# Altium schematic sheet Top.SchDoc
size A1; SheetNumber: 1; SheetTotal: 14
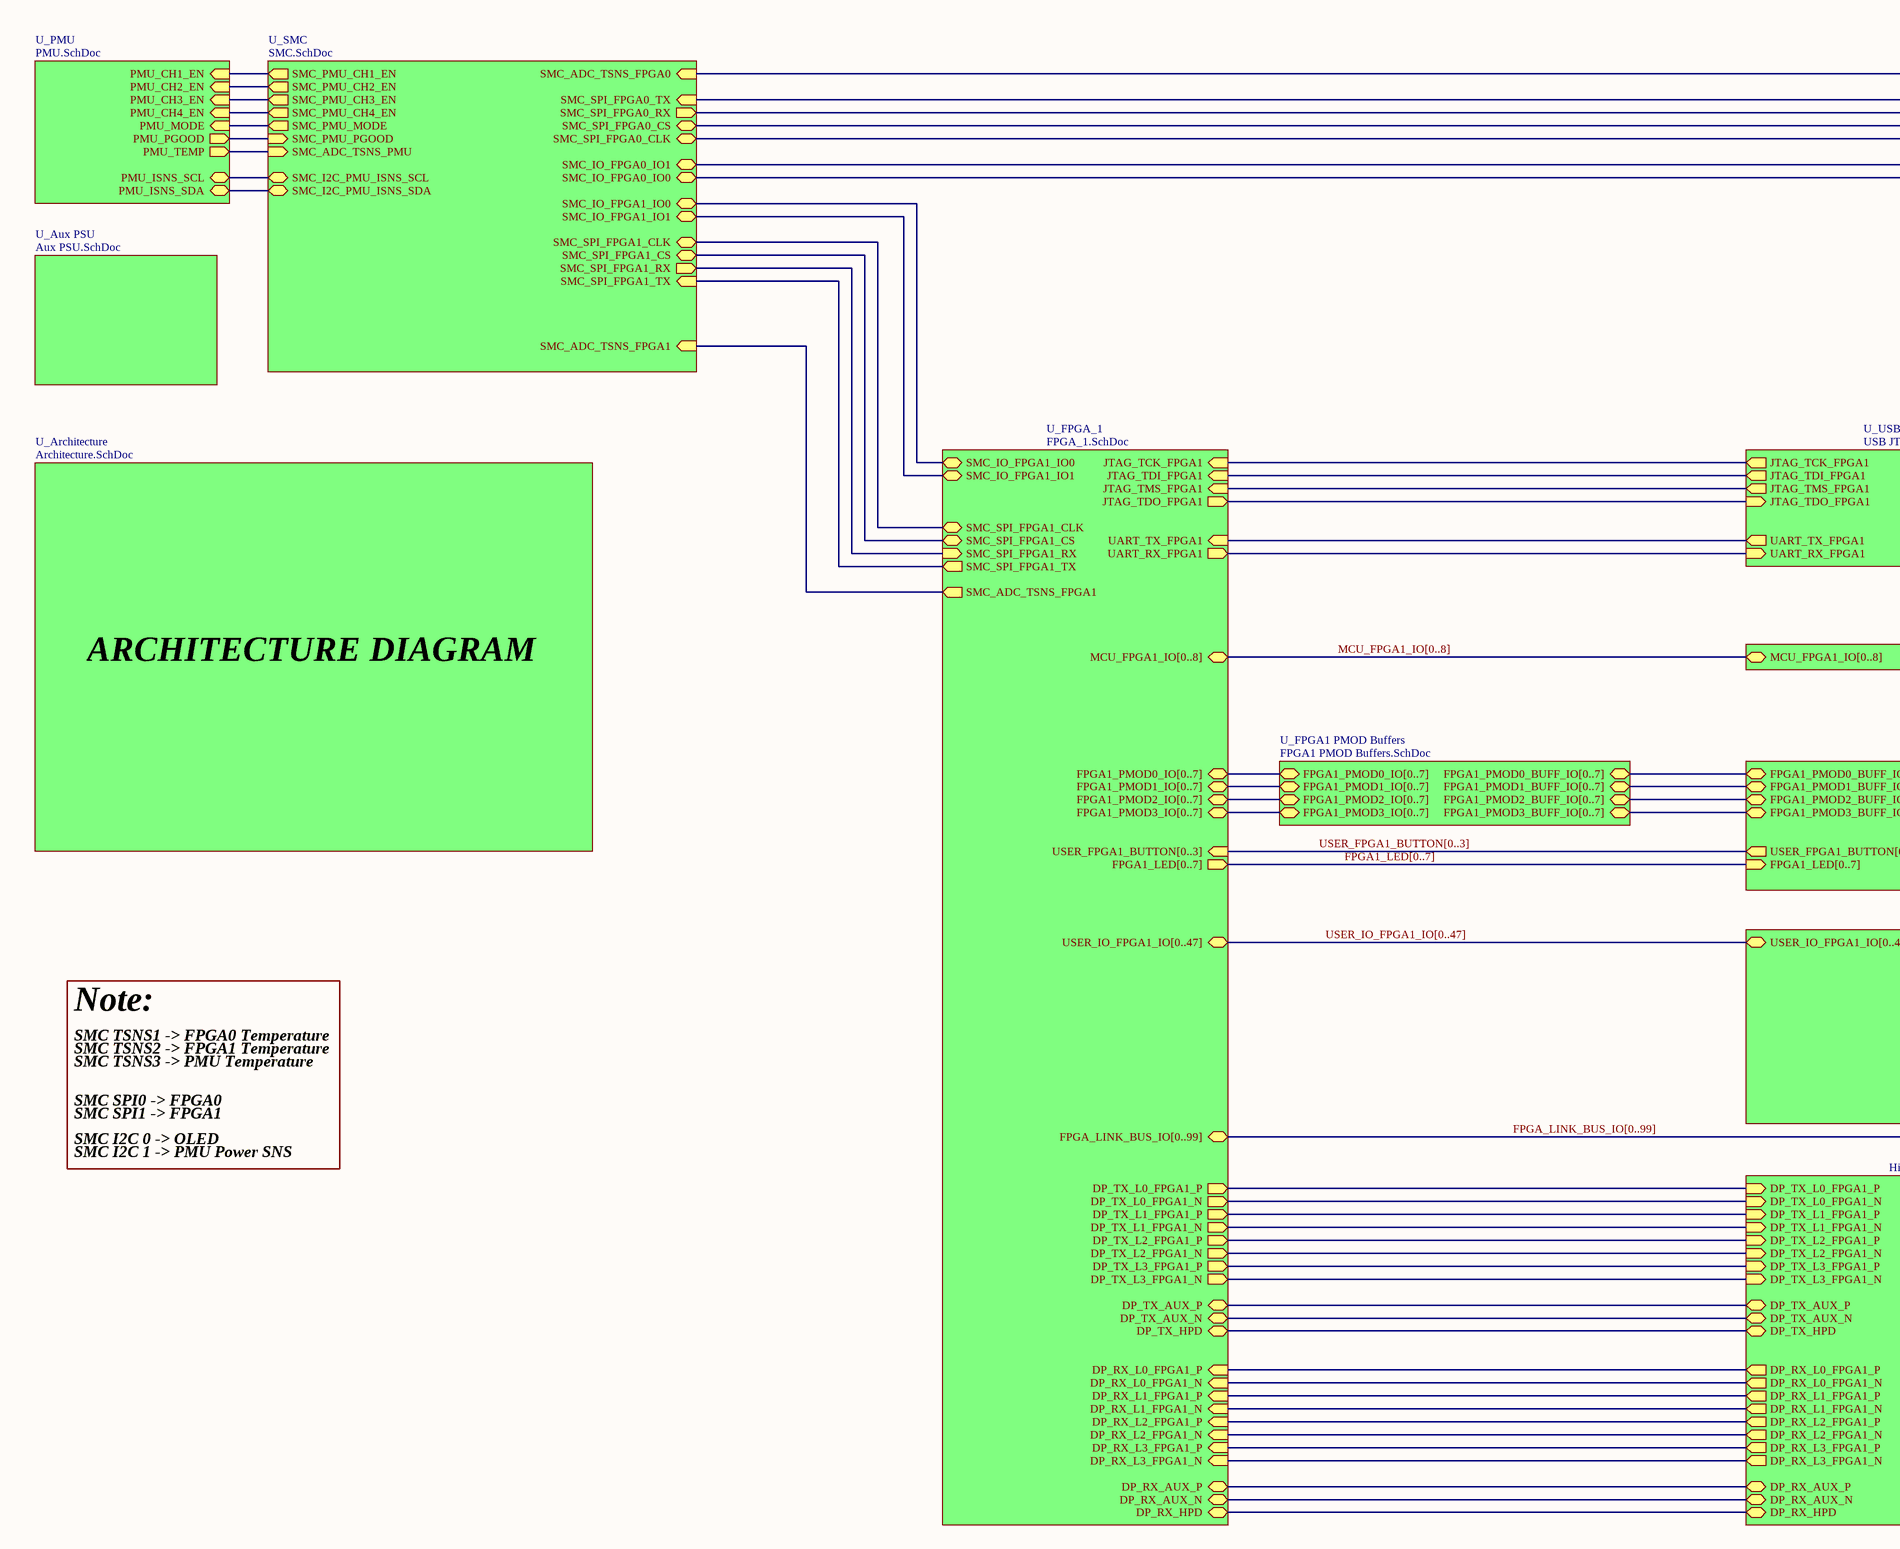
[diagram p0: Top.SchDoc, top left]
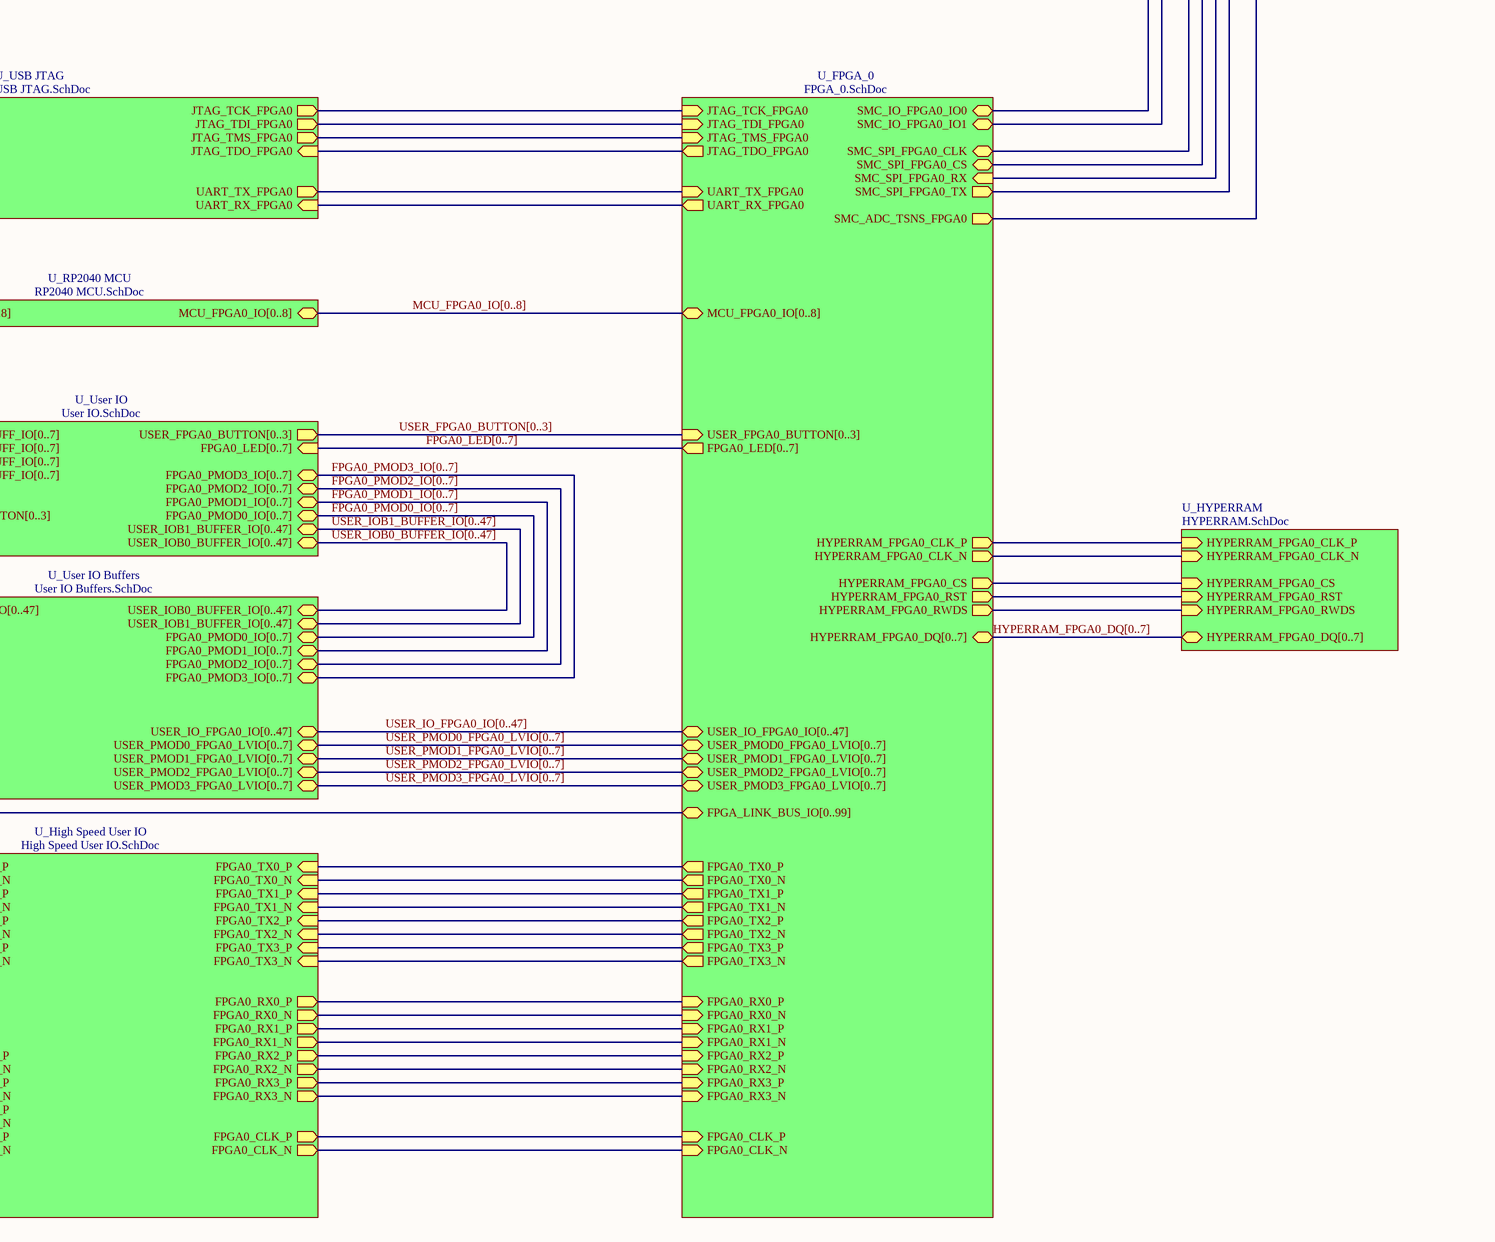
[diagram p1: Top.SchDoc, top right]
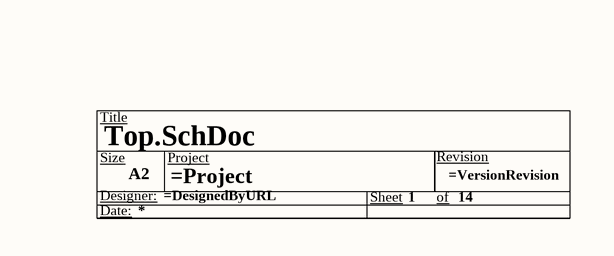
[diagram p2: Top.SchDoc, bottom right]

## Parts
*  Size: A2  (hidden comment: Title Block)  (graphical)

## Sub-sheets
U_Architecture = Architecture.SchDoc: no entries
U_Aux PSU = Aux PSU.SchDoc: no entries
U_FPGA1 PMOD Buffers = FPGA1 PMOD Buffers.SchDoc: FPGA1_PMOD0_IO[0..7] (bidir), FPGA1_PMOD1_IO[0..7] (bidir), FPGA1_PMOD2_IO[0..7] (bidir), FPGA1_PMOD3_IO[0..7] (bidir), FPGA1_PMOD1_BUFF_IO[0..7] (bidir), FPGA1_PMOD2_BUFF_IO[0..7] (bidir), FPGA1_PMOD3_BUFF_IO[0..7] (bidir), FPGA1_PMOD0_BUFF_IO[0..7] (bidir)
U_FPGA_0 = FPGA_0.SchDoc: JTAG_TDO_FPGA0 (out), UART_TX_FPGA0 (in), UART_RX_FPGA0 (out), JTAG_TCK_FPGA0 (in), JTAG_TDI_FPGA0 (in), JTAG_TMS_FPGA0 (in), SMC_IO_FPGA0_IO0 (bidir), SMC_IO_FPGA0_IO1 (bidir), MCU_FPGA0_IO[0..8] (bidir), SMC_SPI_FPGA0_RX (in), SMC_SPI_FPGA0_CS (bidir), SMC_SPI_FPGA0_CLK (bidir), SMC_SPI_FPGA0_TX (out), USER_FPGA0_BUTTON[0..3] (in), FPGA0_LED[0..7] (out), FPGA_LINK_BUS_IO[0..99] (bidir), USER_IO_FPGA0_IO[0..47] (bidir), FPGA0_TX0_P (out), FPGA0_TX0_N (out), FPGA0_TX1_P (out), FPGA0_TX1_N (out), FPGA0_TX2_P (out), FPGA0_TX2_N (out), FPGA0_TX3_P (out), FPGA0_TX3_N (out), FPGA0_RX0_P (in), FPGA0_RX0_N (in), FPGA0_RX1_P (in), FPGA0_RX1_N (in), FPGA0_RX2_P (in), FPGA0_RX2_N (in), FPGA0_RX3_P (in), FPGA0_RX3_N (in), FPGA0_CLK_N (in), FPGA0_CLK_P (in), HYPERRAM_FPGA0_CS (out), HYPERRAM_FPGA0_RWDS (out), HYPERRAM_FPGA0_DQ[0..7] (bidir), HYPERRAM_FPGA0_RST (out), USER_PMOD0_FPGA0_LVIO[0..7] (bidir), USER_PMOD1_FPGA0_LVIO[0..7] (bidir), USER_PMOD2_FPGA0_LVIO[0..7] (bidir), USER_PMOD3_FPGA0_LVIO[0..7] (bidir), HYPERRAM_FPGA0_CLK_P (out), HYPERRAM_FPGA0_CLK_N (out), SMC_ADC_TSNS_FPGA0 (out)
U_FPGA_1 = FPGA_1.SchDoc: JTAG_TDO_FPGA1 (out), UART_TX_FPGA1 (in), UART_RX_FPGA1 (out), JTAG_TCK_FPGA1 (in), JTAG_TDI_FPGA1 (in), JTAG_TMS_FPGA1 (in), DP_RX_L3_FPGA1_P (in), DP_RX_L3_FPGA1_N (in), DP_RX_L2_FPGA1_P (in), DP_RX_L2_FPGA1_N (in), DP_RX_L1_FPGA1_P (in), DP_RX_L1_FPGA1_N (in), DP_RX_L0_FPGA1_P (in), DP_RX_L0_FPGA1_N (in), DP_RX_AUX_P (bidir), DP_RX_AUX_N (bidir), DP_RX_HPD (bidir), DP_TX_L3_FPGA1_P (out), DP_TX_L3_FPGA1_N (out), DP_TX_L2_FPGA1_P (out), DP_TX_L2_FPGA1_N (out), DP_TX_L1_FPGA1_P (out), DP_TX_L1_FPGA1_N (out), DP_TX_L0_FPGA1_P (out), DP_TX_L0_FPGA1_N (out), DP_TX_AUX_P (bidir), DP_TX_AUX_N (bidir), DP_TX_HPD (bidir), SMC_IO_FPGA1_IO0 (bidir), SMC_IO_FPGA1_IO1 (bidir), MCU_FPGA1_IO[0..8] (bidir), SMC_SPI_FPGA1_RX (in), SMC_SPI_FPGA1_CS (bidir), SMC_SPI_FPGA1_CLK (bidir), SMC_SPI_FPGA1_TX (out), USER_FPGA1_BUTTON[0..3] (in), FPGA1_LED[0..7] (out), FPGA_LINK_BUS_IO[0..99] (bidir), USER_IO_FPGA1_IO[0..47] (bidir), FPGA1_PMOD0_IO[0..7] (bidir), FPGA1_PMOD1_IO[0..7] (bidir), FPGA1_PMOD2_IO[0..7] (bidir), FPGA1_PMOD3_IO[0..7] (bidir), SMC_ADC_TSNS_FPGA1 (out)
U_High Speed User IO = High Speed User IO.SchDoc: FPGA0_TX0_P (in), FPGA0_TX0_N (in), FPGA0_TX1_P (in), FPGA0_TX1_N (in), FPGA0_TX2_P (in), FPGA0_TX2_N (in), FPGA0_TX3_P (in), FPGA0_TX3_N (in), FPGA0_RX0_P (out), FPGA0_RX0_N (out), FPGA0_RX1_P (out), FPGA0_RX1_N (out), FPGA0_RX2_P (out), FPGA0_RX2_N (out), FPGA0_RX3_P (out), FPGA0_RX3_N (out), FPGA0_CLK_P (out), FPGA0_CLK_N (out), DP_RX_L3_FPGA1_P (out), DP_RX_L3_FPGA1_N (out), DP_RX_L2_FPGA1_P (out), DP_RX_L2_FPGA1_N (out), DP_RX_L1_FPGA1_P (out), DP_RX_L1_FPGA1_N (out), DP_RX_L0_FPGA1_P (out), DP_RX_L0_FPGA1_N (out), DP_RX_AUX_P (bidir), DP_RX_AUX_N (bidir), DP_RX_HPD (bidir), DP_TX_L3_FPGA1_P (in), DP_TX_L3_FPGA1_N (in), DP_TX_L2_FPGA1_P (in), DP_TX_L2_FPGA1_N (in), DP_TX_L1_FPGA1_P (in), DP_TX_L1_FPGA1_N (in), DP_TX_L0_FPGA1_P (in), DP_TX_L0_FPGA1_N (in), DP_TX_AUX_P (bidir), DP_TX_AUX_N (bidir), DP_TX_HPD (bidir)
U_HYPERRAM = HYPERRAM.SchDoc: HYPERRAM_FPGA0_CLK_P (in), HYPERRAM_FPGA0_CLK_N (in), HYPERRAM_FPGA0_CS (in), HYPERRAM_FPGA0_RST (in), HYPERRAM_FPGA0_RWDS (in), HYPERRAM_FPGA0_DQ[0..7] (bidir)
U_PMU = PMU.SchDoc: PMU_MODE (in), PMU_TEMP (out), PMU_PGOOD (out), PMU_CH1_EN (in), PMU_CH2_EN (in), PMU_CH3_EN (in), PMU_CH4_EN (in), PMU_ISNS_SCL (bidir), PMU_ISNS_SDA (bidir)
U_RP2040 MCU = RP2040 MCU.SchDoc: MCU_FPGA1_IO[0..8] (bidir), MCU_FPGA0_IO[0..8] (bidir)
U_SMC = SMC.SchDoc: SMC_I2C_PMU_ISNS_SDA (bidir), SMC_I2C_PMU_ISNS_SCL (bidir), SMC_PMU_MODE (out), SMC_PMU_CH1_EN (out), SMC_PMU_CH2_EN (out), SMC_PMU_CH3_EN (out), SMC_PMU_CH4_EN (out), SMC_PMU_PGOOD (in), SMC_SPI_FPGA1_RX (out), SMC_SPI_FPGA1_CS (bidir), SMC_SPI_FPGA1_CLK (bidir), SMC_SPI_FPGA1_TX (in), SMC_SPI_FPGA0_RX (out), SMC_SPI_FPGA0_CS (bidir), SMC_SPI_FPGA0_CLK (bidir), SMC_SPI_FPGA0_TX (in), SMC_IO_FPGA1_IO0 (bidir), SMC_IO_FPGA1_IO1 (bidir), SMC_IO_FPGA0_IO0 (bidir), SMC_IO_FPGA0_IO1 (bidir), SMC_ADC_TSNS_PMU (in), SMC_ADC_TSNS_FPGA1 (in), SMC_ADC_TSNS_FPGA0 (in)
U_USB JTAG = USB JTAG.SchDoc: JTAG_TCK_FPGA0 (out), JTAG_TDI_FPGA0 (out), JTAG_TMS_FPGA0 (out), JTAG_TDO_FPGA0 (in), JTAG_TDO_FPGA1 (in), UART_TX_FPGA0 (out), UART_RX_FPGA0 (in), UART_TX_FPGA1 (out), UART_RX_FPGA1 (in), JTAG_TCK_FPGA1 (out), JTAG_TDI_FPGA1 (out), JTAG_TMS_FPGA1 (out)
U_User IO = User IO.SchDoc: FPGA0_PMOD0_IO[0..7] (bidir), FPGA0_PMOD1_IO[0..7] (bidir), FPGA0_PMOD2_IO[0..7] (bidir), FPGA0_PMOD3_IO[0..7] (bidir), FPGA1_PMOD0_BUFF_IO[0..7] (bidir), FPGA1_PMOD1_BUFF_IO[0..7] (bidir), FPGA1_PMOD2_BUFF_IO[0..7] (bidir), FPGA1_PMOD3_BUFF_IO[0..7] (bidir), USER_FPGA0_BUTTON[0..3] (out), USER_FPGA1_BUTTON[0..3] (out), FPGA0_LED[0..7] (in), FPGA1_LED[0..7] (in), USER_IOB0_BUFFER_IO[0..47] (bidir), USER_IOB1_BUFFER_IO[0..47] (bidir)
U_User IO Buffers = User IO Buffers.SchDoc: USER_IO_FPGA1_IO[0..47] (bidir), USER_IOB1_BUFFER_IO[0..47] (bidir), USER_IO_FPGA0_IO[0..47] (bidir), USER_IOB0_BUFFER_IO[0..47] (bidir), FPGA0_PMOD0_IO[0..7] (bidir), USER_PMOD0_FPGA0_LVIO[0..7] (bidir), FPGA0_PMOD1_IO[0..7] (bidir), USER_PMOD1_FPGA0_LVIO[0..7] (bidir), FPGA0_PMOD2_IO[0..7] (bidir), USER_PMOD2_FPGA0_LVIO[0..7] (bidir), FPGA0_PMOD3_IO[0..7] (bidir), USER_PMOD3_FPGA0_LVIO[0..7] (bidir)

## Nets
(unnamed): sheet U_FPGA_0/JTAG_TDO_FPGA0, sheet U_USB JTAG/JTAG_TDO_FPGA0
(unnamed): sheet U_FPGA_0/UART_TX_FPGA0, sheet U_USB JTAG/UART_TX_FPGA0
(unnamed): sheet U_FPGA_0/UART_RX_FPGA0, sheet U_USB JTAG/UART_RX_FPGA0
(unnamed): sheet U_FPGA_0/JTAG_TCK_FPGA0, sheet U_USB JTAG/JTAG_TCK_FPGA0
(unnamed): sheet U_FPGA_0/JTAG_TDI_FPGA0, sheet U_USB JTAG/JTAG_TDI_FPGA0
(unnamed): sheet U_FPGA_0/JTAG_TMS_FPGA0, sheet U_USB JTAG/JTAG_TMS_FPGA0
(unnamed): sheet U_FPGA_0/SMC_IO_FPGA0_IO0, sheet U_SMC/SMC_IO_FPGA0_IO0
(unnamed): sheet U_FPGA_0/SMC_IO_FPGA0_IO1, sheet U_SMC/SMC_IO_FPGA0_IO1
(unnamed): sheet U_FPGA_0/SMC_SPI_FPGA0_RX, sheet U_SMC/SMC_SPI_FPGA0_RX
(unnamed): sheet U_FPGA_0/SMC_SPI_FPGA0_CS, sheet U_SMC/SMC_SPI_FPGA0_CS
(unnamed): sheet U_FPGA_0/SMC_SPI_FPGA0_CLK, sheet U_SMC/SMC_SPI_FPGA0_CLK
(unnamed): sheet U_FPGA_0/SMC_SPI_FPGA0_TX, sheet U_SMC/SMC_SPI_FPGA0_TX
(unnamed): sheet U_FPGA_0/FPGA0_TX0_P, sheet U_High Speed User IO/FPGA0_TX0_P
(unnamed): sheet U_FPGA_0/FPGA0_TX0_N, sheet U_High Speed User IO/FPGA0_TX0_N
(unnamed): sheet U_FPGA_0/FPGA0_TX1_P, sheet U_High Speed User IO/FPGA0_TX1_P
(unnamed): sheet U_FPGA_0/FPGA0_TX1_N, sheet U_High Speed User IO/FPGA0_TX1_N
(unnamed): sheet U_FPGA_0/FPGA0_TX2_P, sheet U_High Speed User IO/FPGA0_TX2_P
(unnamed): sheet U_FPGA_0/FPGA0_TX2_N, sheet U_High Speed User IO/FPGA0_TX2_N
(unnamed): sheet U_FPGA_0/FPGA0_TX3_P, sheet U_High Speed User IO/FPGA0_TX3_P
(unnamed): sheet U_FPGA_0/FPGA0_TX3_N, sheet U_High Speed User IO/FPGA0_TX3_N
(unnamed): sheet U_FPGA_0/FPGA0_RX0_P, sheet U_High Speed User IO/FPGA0_RX0_P
(unnamed): sheet U_FPGA_0/FPGA0_RX0_N, sheet U_High Speed User IO/FPGA0_RX0_N
(unnamed): sheet U_FPGA_0/FPGA0_RX1_P, sheet U_High Speed User IO/FPGA0_RX1_P
(unnamed): sheet U_FPGA_0/FPGA0_RX1_N, sheet U_High Speed User IO/FPGA0_RX1_N
(unnamed): sheet U_FPGA_0/FPGA0_RX2_P, sheet U_High Speed User IO/FPGA0_RX2_P
(unnamed): sheet U_FPGA_0/FPGA0_RX2_N, sheet U_High Speed User IO/FPGA0_RX2_N
(unnamed): sheet U_FPGA_0/FPGA0_RX3_P, sheet U_High Speed User IO/FPGA0_RX3_P
(unnamed): sheet U_FPGA_0/FPGA0_RX3_N, sheet U_High Speed User IO/FPGA0_RX3_N
(unnamed): sheet U_FPGA_0/FPGA0_CLK_N, sheet U_High Speed User IO/FPGA0_CLK_N
(unnamed): sheet U_FPGA_0/FPGA0_CLK_P, sheet U_High Speed User IO/FPGA0_CLK_P
(unnamed): sheet U_FPGA_0/HYPERRAM_FPGA0_CS, sheet U_HYPERRAM/HYPERRAM_FPGA0_CS
(unnamed): sheet U_FPGA_0/HYPERRAM_FPGA0_RWDS, sheet U_HYPERRAM/HYPERRAM_FPGA0_RWDS
(unnamed): sheet U_FPGA_0/HYPERRAM_FPGA0_RST, sheet U_HYPERRAM/HYPERRAM_FPGA0_RST
(unnamed): sheet U_FPGA_0/HYPERRAM_FPGA0_CLK_P, sheet U_HYPERRAM/HYPERRAM_FPGA0_CLK_P
(unnamed): sheet U_FPGA_0/HYPERRAM_FPGA0_CLK_N, sheet U_HYPERRAM/HYPERRAM_FPGA0_CLK_N
(unnamed): sheet U_FPGA_0/SMC_ADC_TSNS_FPGA0, sheet U_SMC/SMC_ADC_TSNS_FPGA0
(unnamed): sheet U_FPGA_1/JTAG_TDO_FPGA1, sheet U_USB JTAG/JTAG_TDO_FPGA1
(unnamed): sheet U_FPGA_1/UART_TX_FPGA1, sheet U_USB JTAG/UART_TX_FPGA1
(unnamed): sheet U_FPGA_1/UART_RX_FPGA1, sheet U_USB JTAG/UART_RX_FPGA1
(unnamed): sheet U_FPGA_1/JTAG_TCK_FPGA1, sheet U_USB JTAG/JTAG_TCK_FPGA1
(unnamed): sheet U_FPGA_1/JTAG_TDI_FPGA1, sheet U_USB JTAG/JTAG_TDI_FPGA1
(unnamed): sheet U_FPGA_1/JTAG_TMS_FPGA1, sheet U_USB JTAG/JTAG_TMS_FPGA1
(unnamed): sheet U_FPGA_1/DP_RX_L3_FPGA1_P, sheet U_High Speed User IO/DP_RX_L3_FPGA1_P
(unnamed): sheet U_FPGA_1/DP_RX_L3_FPGA1_N, sheet U_High Speed User IO/DP_RX_L3_FPGA1_N
(unnamed): sheet U_FPGA_1/DP_RX_L2_FPGA1_P, sheet U_High Speed User IO/DP_RX_L2_FPGA1_P
(unnamed): sheet U_FPGA_1/DP_RX_L2_FPGA1_N, sheet U_High Speed User IO/DP_RX_L2_FPGA1_N
(unnamed): sheet U_FPGA_1/DP_RX_L1_FPGA1_P, sheet U_High Speed User IO/DP_RX_L1_FPGA1_P
(unnamed): sheet U_FPGA_1/DP_RX_L1_FPGA1_N, sheet U_High Speed User IO/DP_RX_L1_FPGA1_N
(unnamed): sheet U_FPGA_1/DP_RX_L0_FPGA1_P, sheet U_High Speed User IO/DP_RX_L0_FPGA1_P
(unnamed): sheet U_FPGA_1/DP_RX_L0_FPGA1_N, sheet U_High Speed User IO/DP_RX_L0_FPGA1_N
(unnamed): sheet U_FPGA_1/DP_RX_AUX_P, sheet U_High Speed User IO/DP_RX_AUX_P
(unnamed): sheet U_FPGA_1/DP_RX_AUX_N, sheet U_High Speed User IO/DP_RX_AUX_N
(unnamed): sheet U_FPGA_1/DP_RX_HPD, sheet U_High Speed User IO/DP_RX_HPD
(unnamed): sheet U_FPGA_1/DP_TX_L3_FPGA1_P, sheet U_High Speed User IO/DP_TX_L3_FPGA1_P
(unnamed): sheet U_FPGA_1/DP_TX_L3_FPGA1_N, sheet U_High Speed User IO/DP_TX_L3_FPGA1_N
(unnamed): sheet U_FPGA_1/DP_TX_L2_FPGA1_P, sheet U_High Speed User IO/DP_TX_L2_FPGA1_P
(unnamed): sheet U_FPGA_1/DP_TX_L2_FPGA1_N, sheet U_High Speed User IO/DP_TX_L2_FPGA1_N
(unnamed): sheet U_FPGA_1/DP_TX_L1_FPGA1_P, sheet U_High Speed User IO/DP_TX_L1_FPGA1_P
(unnamed): sheet U_FPGA_1/DP_TX_L1_FPGA1_N, sheet U_High Speed User IO/DP_TX_L1_FPGA1_N
(unnamed): sheet U_FPGA_1/DP_TX_L0_FPGA1_P, sheet U_High Speed User IO/DP_TX_L0_FPGA1_P
(unnamed): sheet U_FPGA_1/DP_TX_L0_FPGA1_N, sheet U_High Speed User IO/DP_TX_L0_FPGA1_N
(unnamed): sheet U_FPGA_1/DP_TX_AUX_P, sheet U_High Speed User IO/DP_TX_AUX_P
(unnamed): sheet U_FPGA_1/DP_TX_AUX_N, sheet U_High Speed User IO/DP_TX_AUX_N
(unnamed): sheet U_FPGA_1/DP_TX_HPD, sheet U_High Speed User IO/DP_TX_HPD
(unnamed): sheet U_FPGA_1/SMC_IO_FPGA1_IO0, sheet U_SMC/SMC_IO_FPGA1_IO0
(unnamed): sheet U_FPGA_1/SMC_IO_FPGA1_IO1, sheet U_SMC/SMC_IO_FPGA1_IO1
(unnamed): sheet U_FPGA_1/SMC_SPI_FPGA1_RX, sheet U_SMC/SMC_SPI_FPGA1_RX
(unnamed): sheet U_FPGA_1/SMC_SPI_FPGA1_CS, sheet U_SMC/SMC_SPI_FPGA1_CS
(unnamed): sheet U_FPGA_1/SMC_SPI_FPGA1_CLK, sheet U_SMC/SMC_SPI_FPGA1_CLK
(unnamed): sheet U_FPGA_1/SMC_SPI_FPGA1_TX, sheet U_SMC/SMC_SPI_FPGA1_TX
(unnamed): sheet U_FPGA_1/SMC_ADC_TSNS_FPGA1, sheet U_SMC/SMC_ADC_TSNS_FPGA1
(unnamed): sheet U_PMU/PMU_MODE, sheet U_SMC/SMC_PMU_MODE
(unnamed): sheet U_PMU/PMU_TEMP, sheet U_SMC/SMC_ADC_TSNS_PMU
(unnamed): sheet U_PMU/PMU_PGOOD, sheet U_SMC/SMC_PMU_PGOOD
(unnamed): sheet U_PMU/PMU_CH1_EN, sheet U_SMC/SMC_PMU_CH1_EN
(unnamed): sheet U_PMU/PMU_CH2_EN, sheet U_SMC/SMC_PMU_CH2_EN
(unnamed): sheet U_PMU/PMU_CH3_EN, sheet U_SMC/SMC_PMU_CH3_EN
(unnamed): sheet U_PMU/PMU_CH4_EN, sheet U_SMC/SMC_PMU_CH4_EN
(unnamed): sheet U_PMU/PMU_ISNS_SCL, sheet U_SMC/SMC_I2C_PMU_ISNS_SCL
(unnamed): sheet U_PMU/PMU_ISNS_SDA, sheet U_SMC/SMC_I2C_PMU_ISNS_SDA

## Buses and harness runs
bus FPGA0_LED[0..7] = sheet U_FPGA_0/FPGA0_LED[0..7] = sheet U_User IO/FPGA0_LED[0..7]
bus FPGA0_PMOD0_IO[0..7] = sheet U_User IO Buffers/FPGA0_PMOD0_IO[0..7] = sheet U_User IO/FPGA0_PMOD0_IO[0..7]
bus FPGA0_PMOD1_IO[0..7] = sheet U_User IO Buffers/FPGA0_PMOD1_IO[0..7] = sheet U_User IO/FPGA0_PMOD1_IO[0..7]
bus FPGA0_PMOD2_IO[0..7] = sheet U_User IO Buffers/FPGA0_PMOD2_IO[0..7] = sheet U_User IO/FPGA0_PMOD2_IO[0..7]
bus FPGA0_PMOD3_IO[0..7] = sheet U_User IO Buffers/FPGA0_PMOD3_IO[0..7] = sheet U_User IO/FPGA0_PMOD3_IO[0..7]
bus FPGA1_LED[0..7] = sheet U_FPGA_1/FPGA1_LED[0..7] = sheet U_User IO/FPGA1_LED[0..7]
bus FPGA_LINK_BUS_IO[0..99] = sheet U_FPGA_0/FPGA_LINK_BUS_IO[0..99] = sheet U_FPGA_1/FPGA_LINK_BUS_IO[0..99]
bus HYPERRAM_FPGA0_DQ[0..7] = sheet U_FPGA_0/HYPERRAM_FPGA0_DQ[0..7] = sheet U_HYPERRAM/HYPERRAM_FPGA0_DQ[0..7]
bus MCU_FPGA0_IO[0..8] = sheet U_FPGA_0/MCU_FPGA0_IO[0..8] = sheet U_RP2040 MCU/MCU_FPGA0_IO[0..8]
bus MCU_FPGA1_IO[0..8] = sheet U_FPGA_1/MCU_FPGA1_IO[0..8] = sheet U_RP2040 MCU/MCU_FPGA1_IO[0..8]
bus sheet U_FPGA1 PMOD Buffers/FPGA1_PMOD0_BUFF_IO[0..7] = sheet U_User IO/FPGA1_PMOD0_BUFF_IO[0..7]
bus sheet U_FPGA1 PMOD Buffers/FPGA1_PMOD0_IO[0..7] = sheet U_FPGA_1/FPGA1_PMOD0_IO[0..7]
bus sheet U_FPGA1 PMOD Buffers/FPGA1_PMOD1_BUFF_IO[0..7] = sheet U_User IO/FPGA1_PMOD1_BUFF_IO[0..7]
bus sheet U_FPGA1 PMOD Buffers/FPGA1_PMOD1_IO[0..7] = sheet U_FPGA_1/FPGA1_PMOD1_IO[0..7]
bus sheet U_FPGA1 PMOD Buffers/FPGA1_PMOD2_BUFF_IO[0..7] = sheet U_User IO/FPGA1_PMOD2_BUFF_IO[0..7]
bus sheet U_FPGA1 PMOD Buffers/FPGA1_PMOD2_IO[0..7] = sheet U_FPGA_1/FPGA1_PMOD2_IO[0..7]
bus sheet U_FPGA1 PMOD Buffers/FPGA1_PMOD3_BUFF_IO[0..7] = sheet U_User IO/FPGA1_PMOD3_BUFF_IO[0..7]
bus sheet U_FPGA1 PMOD Buffers/FPGA1_PMOD3_IO[0..7] = sheet U_FPGA_1/FPGA1_PMOD3_IO[0..7]
bus USER_FPGA0_BUTTON[0..3] = sheet U_FPGA_0/USER_FPGA0_BUTTON[0..3] = sheet U_User IO/USER_FPGA0_BUTTON[0..3]
bus USER_FPGA1_BUTTON[0..3] = sheet U_FPGA_1/USER_FPGA1_BUTTON[0..3] = sheet U_User IO/USER_FPGA1_BUTTON[0..3]
bus USER_IO_FPGA0_IO[0..47] = sheet U_FPGA_0/USER_IO_FPGA0_IO[0..47] = sheet U_User IO Buffers/USER_IO_FPGA0_IO[0..47]
bus USER_IO_FPGA1_IO[0..47] = sheet U_FPGA_1/USER_IO_FPGA1_IO[0..47] = sheet U_User IO Buffers/USER_IO_FPGA1_IO[0..47]
bus USER_IOB0_BUFFER_IO[0..47] = sheet U_User IO Buffers/USER_IOB0_BUFFER_IO[0..47] = sheet U_User IO/USER_IOB0_BUFFER_IO[0..47]
bus USER_IOB1_BUFFER_IO[0..47] = sheet U_User IO Buffers/USER_IOB1_BUFFER_IO[0..47] = sheet U_User IO/USER_IOB1_BUFFER_IO[0..47]
bus USER_PMOD0_FPGA0_LVIO[0..7] = sheet U_FPGA_0/USER_PMOD0_FPGA0_LVIO[0..7] = sheet U_User IO Buffers/USER_PMOD0_FPGA0_LVIO[0..7]
bus USER_PMOD1_FPGA0_LVIO[0..7] = sheet U_FPGA_0/USER_PMOD1_FPGA0_LVIO[0..7] = sheet U_User IO Buffers/USER_PMOD1_FPGA0_LVIO[0..7]
bus USER_PMOD2_FPGA0_LVIO[0..7] = sheet U_FPGA_0/USER_PMOD2_FPGA0_LVIO[0..7] = sheet U_User IO Buffers/USER_PMOD2_FPGA0_LVIO[0..7]
bus USER_PMOD3_FPGA0_LVIO[0..7] = sheet U_FPGA_0/USER_PMOD3_FPGA0_LVIO[0..7] = sheet U_User IO Buffers/USER_PMOD3_FPGA0_LVIO[0..7]

## Notes on the sheet
- ARCHITECTURE DIAGRAM
- Note:
- SMC TSNS1 -> FPGA0 Temperature
- SMC TSNS2 -> FPGA1 Temperature
- SMC TSNS3 -> PMU Temperature
- SMC SPI0 -> FPGA0
- SMC SPI1 -> FPGA1
- SMC I2C 0 -> OLED
- SMC I2C 1 -> PMU Power SNS
- (in symbol CMP-007-000006-8) Title; Size; Project; Revision; Designer:; Sheet; of; Date:

## Library data of the parts
* = CMP-007-000006-8: Generic Title Block